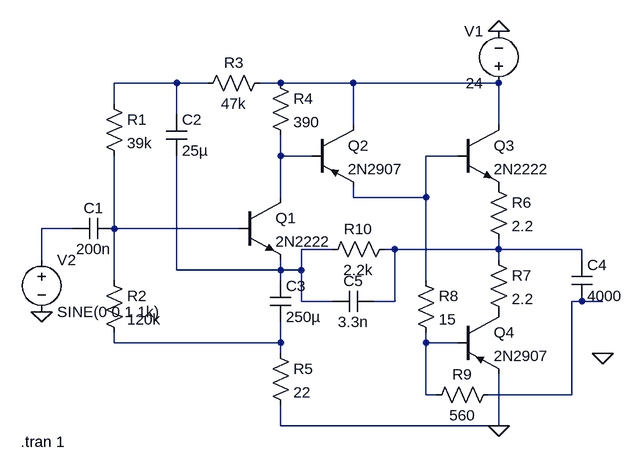
[diagram p0: schematic audio_amplifer.asc]
audio_amplifer.asc, the LTspice schematic file:
Version 4.1
SHEET 1 976 680
WIRE 240 -96 144 -96
WIRE 288 -96 240 -96
WIRE 400 -96 368 -96
WIRE 512 -96 400 -96
WIRE 736 -96 512 -96
WIRE 144 -64 144 -96
WIRE 240 -48 240 -96
WIRE 512 -32 512 -96
WIRE 736 -32 736 -96
WIRE 400 16 400 -16
WIRE 448 16 400 16
WIRE 672 16 624 16
WIRE 400 80 400 16
WIRE 512 80 512 64
WIRE 624 80 624 16
WIRE 624 80 512 80
WIRE 80 128 32 128
WIRE 144 128 144 16
WIRE 336 128 144 128
WIRE 480 160 432 160
WIRE 576 160 560 160
WIRE 736 160 736 144
WIRE 736 160 576 160
WIRE 864 160 736 160
WIRE 32 176 32 128
WIRE 736 176 736 160
WIRE 864 176 864 160
WIRE 240 192 240 16
WIRE 400 192 400 176
WIRE 400 192 240 192
WIRE 432 192 432 160
WIRE 432 192 400 192
WIRE 144 208 144 128
WIRE 400 208 400 192
WIRE 624 208 624 80
WIRE 432 240 432 192
WIRE 480 240 432 240
WIRE 576 240 576 160
WIRE 576 240 544 240
WIRE 864 240 848 240
WIRE 896 240 864 240
WIRE 144 304 144 288
WIRE 400 304 400 272
WIRE 400 304 144 304
WIRE 624 304 624 288
WIRE 672 304 624 304
WIRE 400 320 400 304
WIRE 624 384 624 304
WIRE 640 384 624 384
WIRE 848 384 848 240
WIRE 848 384 720 384
WIRE 400 432 400 400
WIRE 736 432 736 352
WIRE 736 432 400 432
FLAG 736 432 0
FLAG 736 -176 0
FLAG 896 320 0
FLAG 32 256 0
SYMBOL cap 144 112 R90
WINDOW 0 0 32 VBottom 2
WINDOW 3 32 32 VTop 2
SYMATTR InstName C1
SYMATTR Value 200n
SYMBOL res 128 -80 R0
SYMATTR InstName R1
SYMATTR Value 39k
SYMBOL res 128 192 R0
SYMATTR InstName R2
SYMATTR Value 120k
SYMBOL cap 224 -48 R0
SYMATTR InstName C2
SYMATTR Value 25µ
SYMBOL res 384 -112 R90
WINDOW 0 0 56 VBottom 2
WINDOW 3 32 56 VTop 2
SYMATTR InstName R3
SYMATTR Value 47k
SYMBOL npn 336 80 R0
SYMATTR InstName Q1
SYMATTR Value 2N2222
SYMBOL res 384 -112 R0
SYMATTR InstName R4
SYMATTR Value 390
SYMBOL cap 384 208 R0
SYMATTR InstName C3
SYMATTR Value 250µ
SYMBOL res 384 304 R0
SYMATTR InstName R5
SYMATTR Value 22
SYMBOL pnp 448 -32 R0
SYMATTR InstName Q2
SYMATTR Value 2N2907
SYMBOL npn 672 -32 R0
SYMATTR InstName Q3
SYMATTR Value 2N2222
SYMBOL res 720 48 R0
SYMATTR InstName R6
SYMATTR Value 2.2
SYMBOL res 720 160 R0
SYMATTR InstName R7
SYMATTR Value 2.2
SYMBOL pnp 672 256 R0
SYMATTR InstName Q4
SYMATTR Value 2N2907
SYMBOL res 608 192 R0
SYMATTR InstName R8
SYMATTR Value 15
SYMBOL res 736 368 R90
WINDOW 0 0 56 VBottom 2
WINDOW 3 32 56 VTop 2
SYMATTR InstName R9
SYMATTR Value 560
SYMBOL cap 848 176 R0
SYMATTR InstName C4
SYMATTR Value 4000
SYMBOL res 576 144 R90
WINDOW 0 0 56 VBottom 2
WINDOW 3 32 56 VTop 2
SYMATTR InstName R10
SYMATTR Value 2.2k
SYMBOL cap 544 224 R90
WINDOW 0 0 32 VBottom 2
WINDOW 3 32 32 VTop 2
SYMATTR InstName C5
SYMATTR Value 3.3n
SYMBOL voltage 736 -80 R180
WINDOW 0 24 96 Left 2
WINDOW 3 24 16 Left 2
WINDOW 123 0 0 Left 0
WINDOW 39 0 0 Left 0
SYMATTR InstName V1
SYMATTR Value 24
SYMBOL voltage 32 160 R0
WINDOW 123 0 0 Left 0
WINDOW 39 0 0 Left 0
SYMATTR InstName V2
SYMATTR Value SINE(0 0.1 1k)
TEXT 0 456 Left 2 !.tran 1

The netlist it stands for:
* audio_amplifer.asc
C1 N006 N005 200n
R1 N001 N006 39k
R2 N006 N010 120k
C2 N001 N007 25µ
R3 N002 N001 47k
Q1 N003 N006 N007 0 2N2222
R4 N002 N003 390
C3 N007 N010 250µ
R5 N010 0 22
Q2 N002 N003 N004 0 2N2907
Q3 N002 N004 P001 0 2N2222
R6 P001 N008 2.2
R7 N008 P002 2.2
Q4 P002 N011 0 0 2N2907
R8 N004 N011 15
R9 N009 N011 560
C4 N008 N009 4000
R10 N008 N007 2.2k
C5 N008 N007 3.3n
V1 N002 0 24
V2 N005 0 SINE(0 0.1 1k)
.model NPN NPN
.model PNP PNP
.lib standard.bjt
.tran 1
.backanno
.end